# EAGLE schematic framMega (EAGLE 8.3.0)

## Sheet 1 of 9
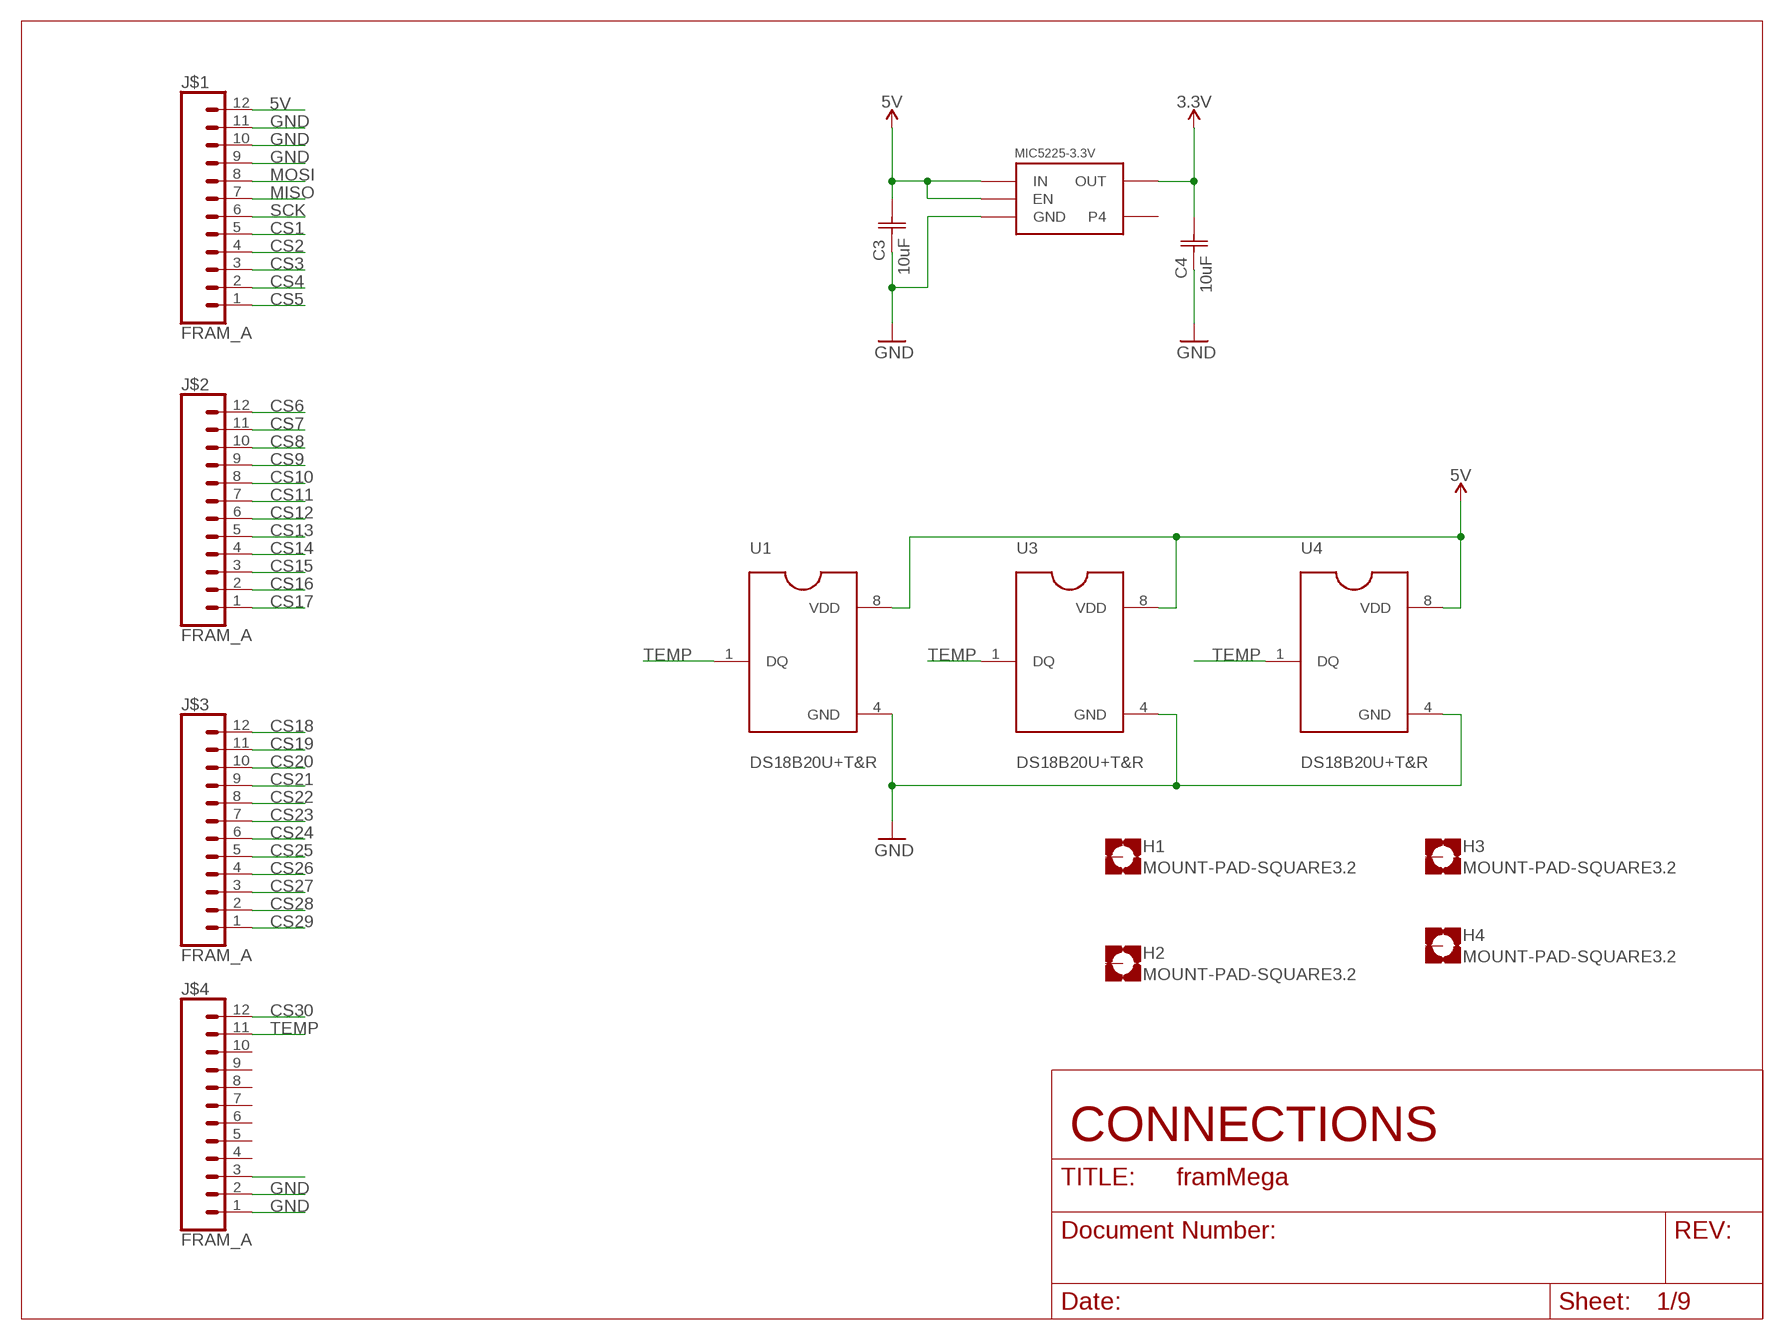
[diagram p0: schematic, sheet 1]

### Parts
C3  10uF  CAP_10UF  [CAP_GRM219R61A106KE44D]
C4  10uF  CAP_10UF  [CAP_GRM219R61A106KE44D]
H1  MOUNT-PAD-SQUARE3.2  [3,2-PAD-SQUARE]
H2  MOUNT-PAD-SQUARE3.2  [3,2-PAD-SQUARE]
H3  MOUNT-PAD-SQUARE3.2  [3,2-PAD-SQUARE]
H4  MOUNT-PAD-SQUARE3.2  [3,2-PAD-SQUARE]
J$1  FRAM_A  WIREPOST  [WIREWRAPPOST]
J$2  FRAM_A  WIREPOST  [WIREWRAPPOST]
J$3  FRAM_A  WIREPOST  [WIREWRAPPOST]
J$4  FRAM_A  WIREPOST  [WIREWRAPPOST]
U1  DS18B20U+T&R  [SOP65P500X110-8N]
U2  MIC5225  [SOT23-5]
U3  DS18B20U+T&R  [SOP65P500X110-8N]
U4  DS18B20U+T&R  [SOP65P500X110-8N]

### Nets
3.3V: C4.2 U2.OUT ; also sheet 2,3,4,5,6,7,8,9
5V [power usb]: C3.2 J$1.12 J$4.3 U1.8(VDD) U2.EN U2.IN U3.8(VDD) U4.8(VDD) ; also sheet 2,3,4
CS1: J$1.5 ; also sheet 2
CS2: J$1.4 ; also sheet 2
CS3: J$1.3 ; also sheet 2
CS4: J$1.2 ; also sheet 2
CS5: J$1.1 ; also sheet 2
CS6: J$2.12 ; also sheet 2
CS7: J$2.11 ; also sheet 2
CS8: J$2.10 ; also sheet 2
CS9: J$2.9 ; also sheet 2
CS10: J$2.8 ; also sheet 2
CS11: J$2.7 ; also sheet 2
CS12: J$2.6 ; also sheet 3
CS13: J$2.5 ; also sheet 3
CS14: J$2.4 ; also sheet 3
CS15: J$2.3 ; also sheet 3
CS16: J$2.2 ; also sheet 3
CS17: J$2.1 ; also sheet 3
CS18: J$3.12 ; also sheet 3
CS19: J$3.11 ; also sheet 3
CS20: J$3.10 ; also sheet 3
CS21: J$3.9 ; also sheet 3
CS22: J$3.8 ; also sheet 3
CS23: J$3.7 ; also sheet 3
CS24: J$3.6 ; also sheet 3
CS25: J$3.5 ; also sheet 3
CS26: J$3.4 ; also sheet 3
CS27: J$3.3 ; also sheet 3
CS28: J$3.2 ; also sheet 4
CS29: J$3.1 ; also sheet 4
CS30: J$4.12 ; also sheet 4
GND [gnd]: C3.1 C4.1 J$1.9 J$1.10 J$1.11 J$4.1 J$4.2 U1.4(GND) U2.GND U3.4(GND) U4.4(GND) ; also sheet 5,6,7,8,9
MISO: J$1.7 ; also sheet 2
MOSI: J$1.8 ; also sheet 2
SCK: J$1.6 ; also sheet 2
TEMP: J$4.11 U1.1(DQ) U3.1(DQ) U4.1(DQ)
Unconnected: H1.B3,2(MOUNT) H2.B3,2(MOUNT) H3.B3,2(MOUNT) H4.B3,2(MOUNT) J$4.4 J$4.5 J$4.6 J$4.7 J$4.8 J$4.9 J$4.10 U2.NC/ADJ(P4)

### Notes on the sheet
- CONNECTIONS

## Sheet 2 of 9
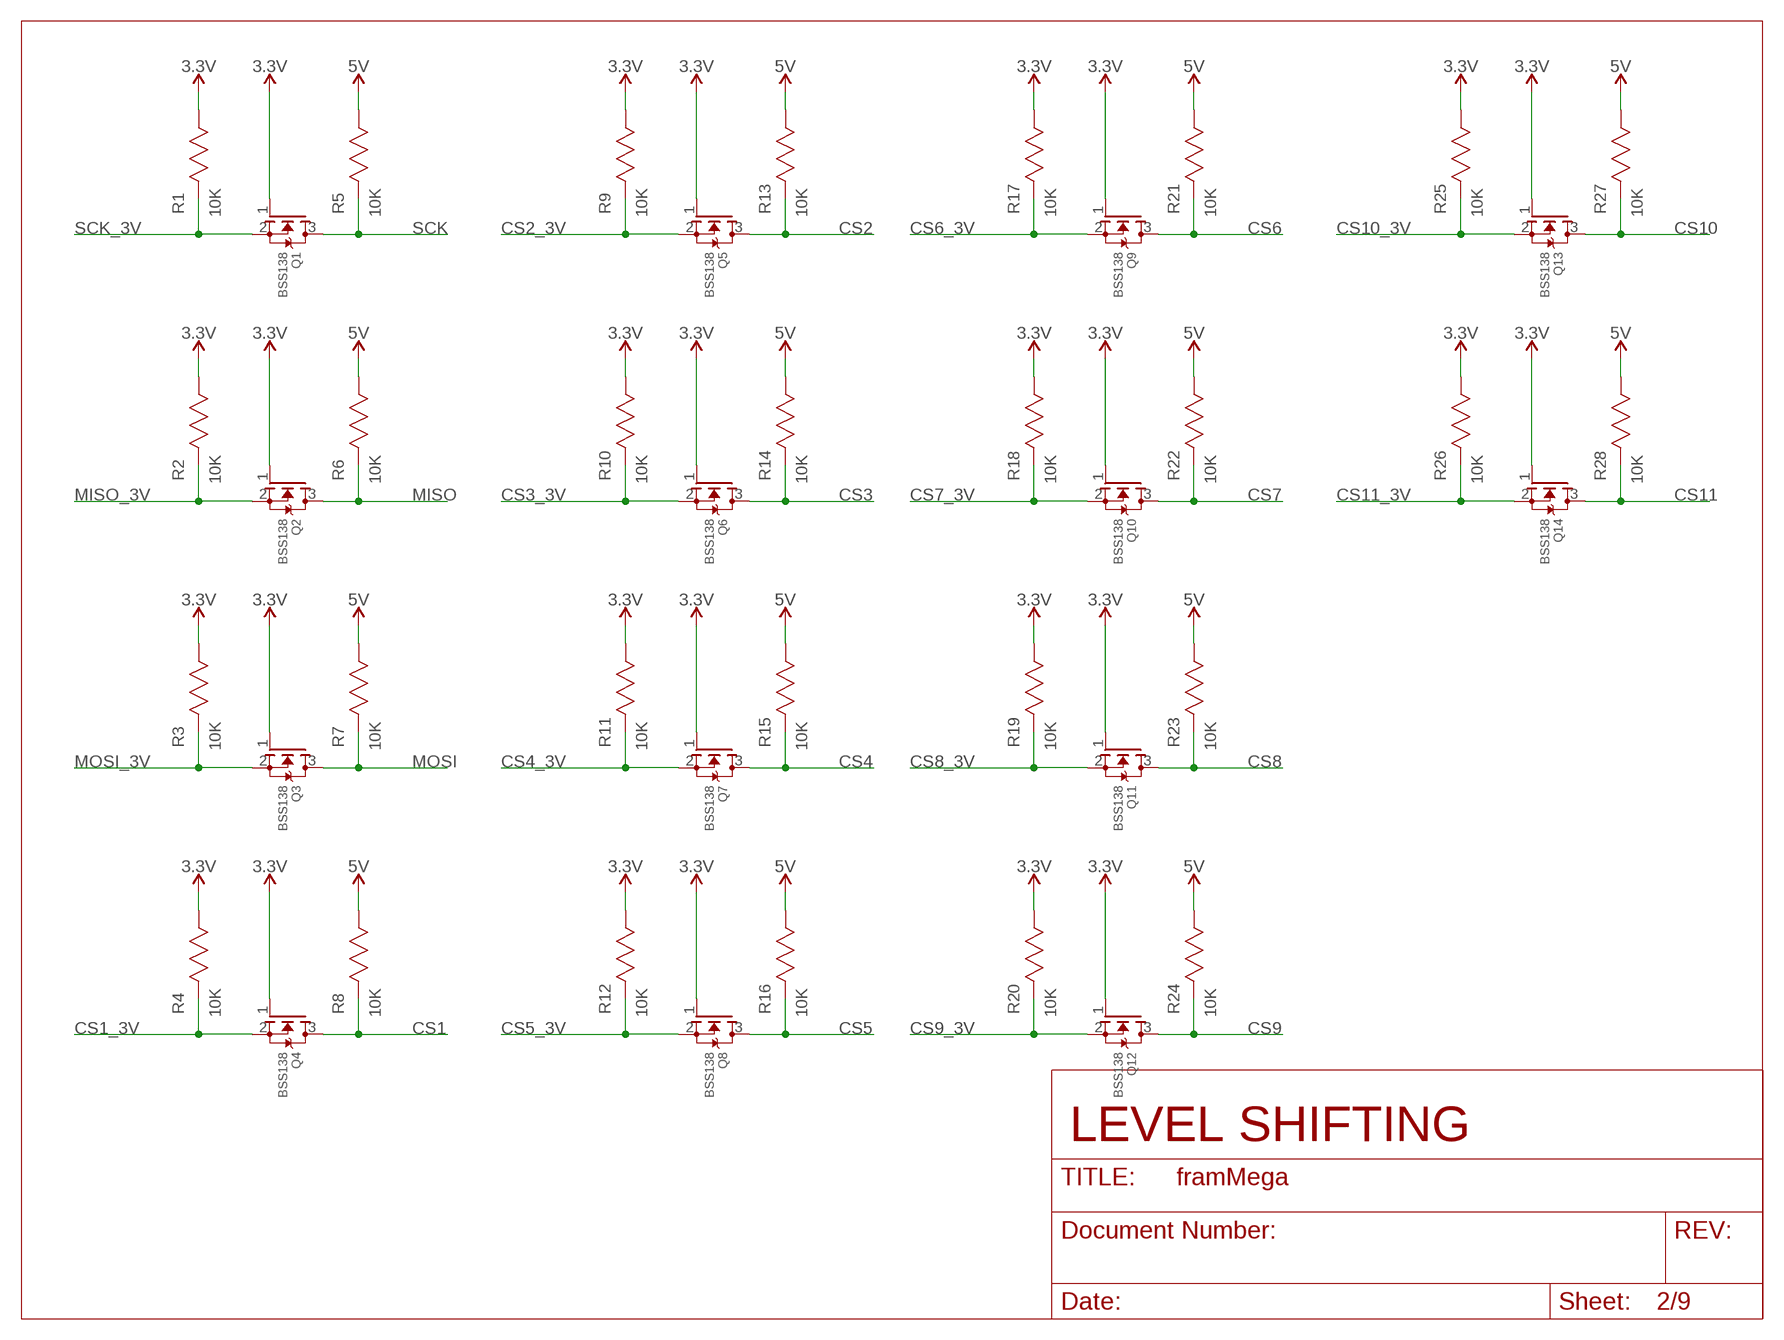
[diagram p1: schematic, sheet 2]

### Parts
Q1  BSS138  MOSFET-NWIDE  [SOT23-WIDE]
Q2  BSS138  MOSFET-NWIDE  [SOT23-WIDE]
Q3  BSS138  MOSFET-NWIDE  [SOT23-WIDE]
Q4  BSS138  MOSFET-NWIDE  [SOT23-WIDE]
Q5  BSS138  MOSFET-NWIDE  [SOT23-WIDE]
Q6  BSS138  MOSFET-NWIDE  [SOT23-WIDE]
Q7  BSS138  MOSFET-NWIDE  [SOT23-WIDE]
Q8  BSS138  MOSFET-NWIDE  [SOT23-WIDE]
Q9  BSS138  MOSFET-NWIDE  [SOT23-WIDE]
Q10  BSS138  MOSFET-NWIDE  [SOT23-WIDE]
Q11  BSS138  MOSFET-NWIDE  [SOT23-WIDE]
Q12  BSS138  MOSFET-NWIDE  [SOT23-WIDE]
Q13  BSS138  MOSFET-NWIDE  [SOT23-WIDE]
Q14  BSS138  MOSFET-NWIDE  [SOT23-WIDE]
R1  10K  RES_10K  [RC0603N]
R2  10K  RES_10K  [RC0603N]
R3  10K  RES_10K  [RC0603N]
R4  10K  RES_10K  [RC0603N]
R5  10K  RES_10K  [RC0603N]
R6  10K  RES_10K  [RC0603N]
R7  10K  RES_10K  [RC0603N]
R8  10K  RES_10K  [RC0603N]
R9  10K  RES_10K  [RC0603N]
R10  10K  RES_10K  [RC0603N]
R11  10K  RES_10K  [RC0603N]
R12  10K  RES_10K  [RC0603N]
R13  10K  RES_10K  [RC0603N]
R14  10K  RES_10K  [RC0603N]
R15  10K  RES_10K  [RC0603N]
R16  10K  RES_10K  [RC0603N]
R17  10K  RES_10K  [RC0603N]
R18  10K  RES_10K  [RC0603N]
R19  10K  RES_10K  [RC0603N]
R20  10K  RES_10K  [RC0603N]
R21  10K  RES_10K  [RC0603N]
R22  10K  RES_10K  [RC0603N]
R23  10K  RES_10K  [RC0603N]
R24  10K  RES_10K  [RC0603N]
R25  10K  RES_10K  [RC0603N]
R26  10K  RES_10K  [RC0603N]
R27  10K  RES_10K  [RC0603N]
R28  10K  RES_10K  [RC0603N]

### Nets
3.3V: Q1.1(G) Q2.1(G) Q3.1(G) Q4.1(G) Q5.1(G) Q6.1(G) Q7.1(G) Q8.1(G) Q9.1(G) Q10.1(G) Q11.1(G) Q12.1(G) Q13.1(G) Q14.1(G) R1.1 R2.1 R3.1 R4.1 R9.1 R10.1 R11.1 R12.1 R17.1 R18.1 R19.1 R20.1 R25.1 R26.1 ; also sheet 1,3,4,5,6,7,8,9
5V [power usb]: R5.1 R6.1 R7.1 R8.1 R13.1 R14.1 R15.1 R16.1 R21.1 R22.1 R23.1 R24.1 R27.1 R28.1 ; also sheet 1,3,4
CS1: Q4.3(D) R8.2 ; also sheet 1
CS1_3V: Q4.2(S) R4.2 ; also sheet 5
CS2: Q5.3(D) R13.2 ; also sheet 1
CS2_3V: Q5.2(S) R9.2 ; also sheet 5
CS3: Q6.3(D) R14.2 ; also sheet 1
CS3_3V: Q6.2(S) R10.2 ; also sheet 5
CS4: Q7.3(D) R15.2 ; also sheet 1
CS4_3V: Q7.2(S) R11.2 ; also sheet 5
CS5: Q8.3(D) R16.2 ; also sheet 1
CS5_3V: Q8.2(S) R12.2 ; also sheet 5
CS6: Q9.3(D) R21.2 ; also sheet 1
CS6_3V: Q9.2(S) R17.2 ; also sheet 5
CS7: Q10.3(D) R22.2 ; also sheet 1
CS7_3V: Q10.2(S) R18.2 ; also sheet 6
CS8: Q11.3(D) R23.2 ; also sheet 1
CS8_3V: Q11.2(S) R19.2 ; also sheet 6
CS9: Q12.3(D) R24.2 ; also sheet 1
CS9_3V: Q12.2(S) R20.2 ; also sheet 6
CS10: Q13.3(D) R27.2 ; also sheet 1
CS10_3V: Q13.2(S) R25.2 ; also sheet 6
CS11: Q14.3(D) R28.2 ; also sheet 1
CS11_3V: Q14.2(S) R26.2 ; also sheet 6
MISO: Q2.3(D) R6.2 ; also sheet 1
MISO_3V: Q2.2(S) R2.2 ; also sheet 5,6,7,8,9
MOSI: Q3.3(D) R7.2 ; also sheet 1
MOSI_3V: Q3.2(S) R3.2 ; also sheet 5,6,7,8,9
SCK: Q1.3(D) R5.2 ; also sheet 1
SCK_3V: Q1.2(S) R1.2 ; also sheet 5,6,7,8,9

### Notes on the sheet
- LEVEL SHIFTING

## Sheet 3 of 9
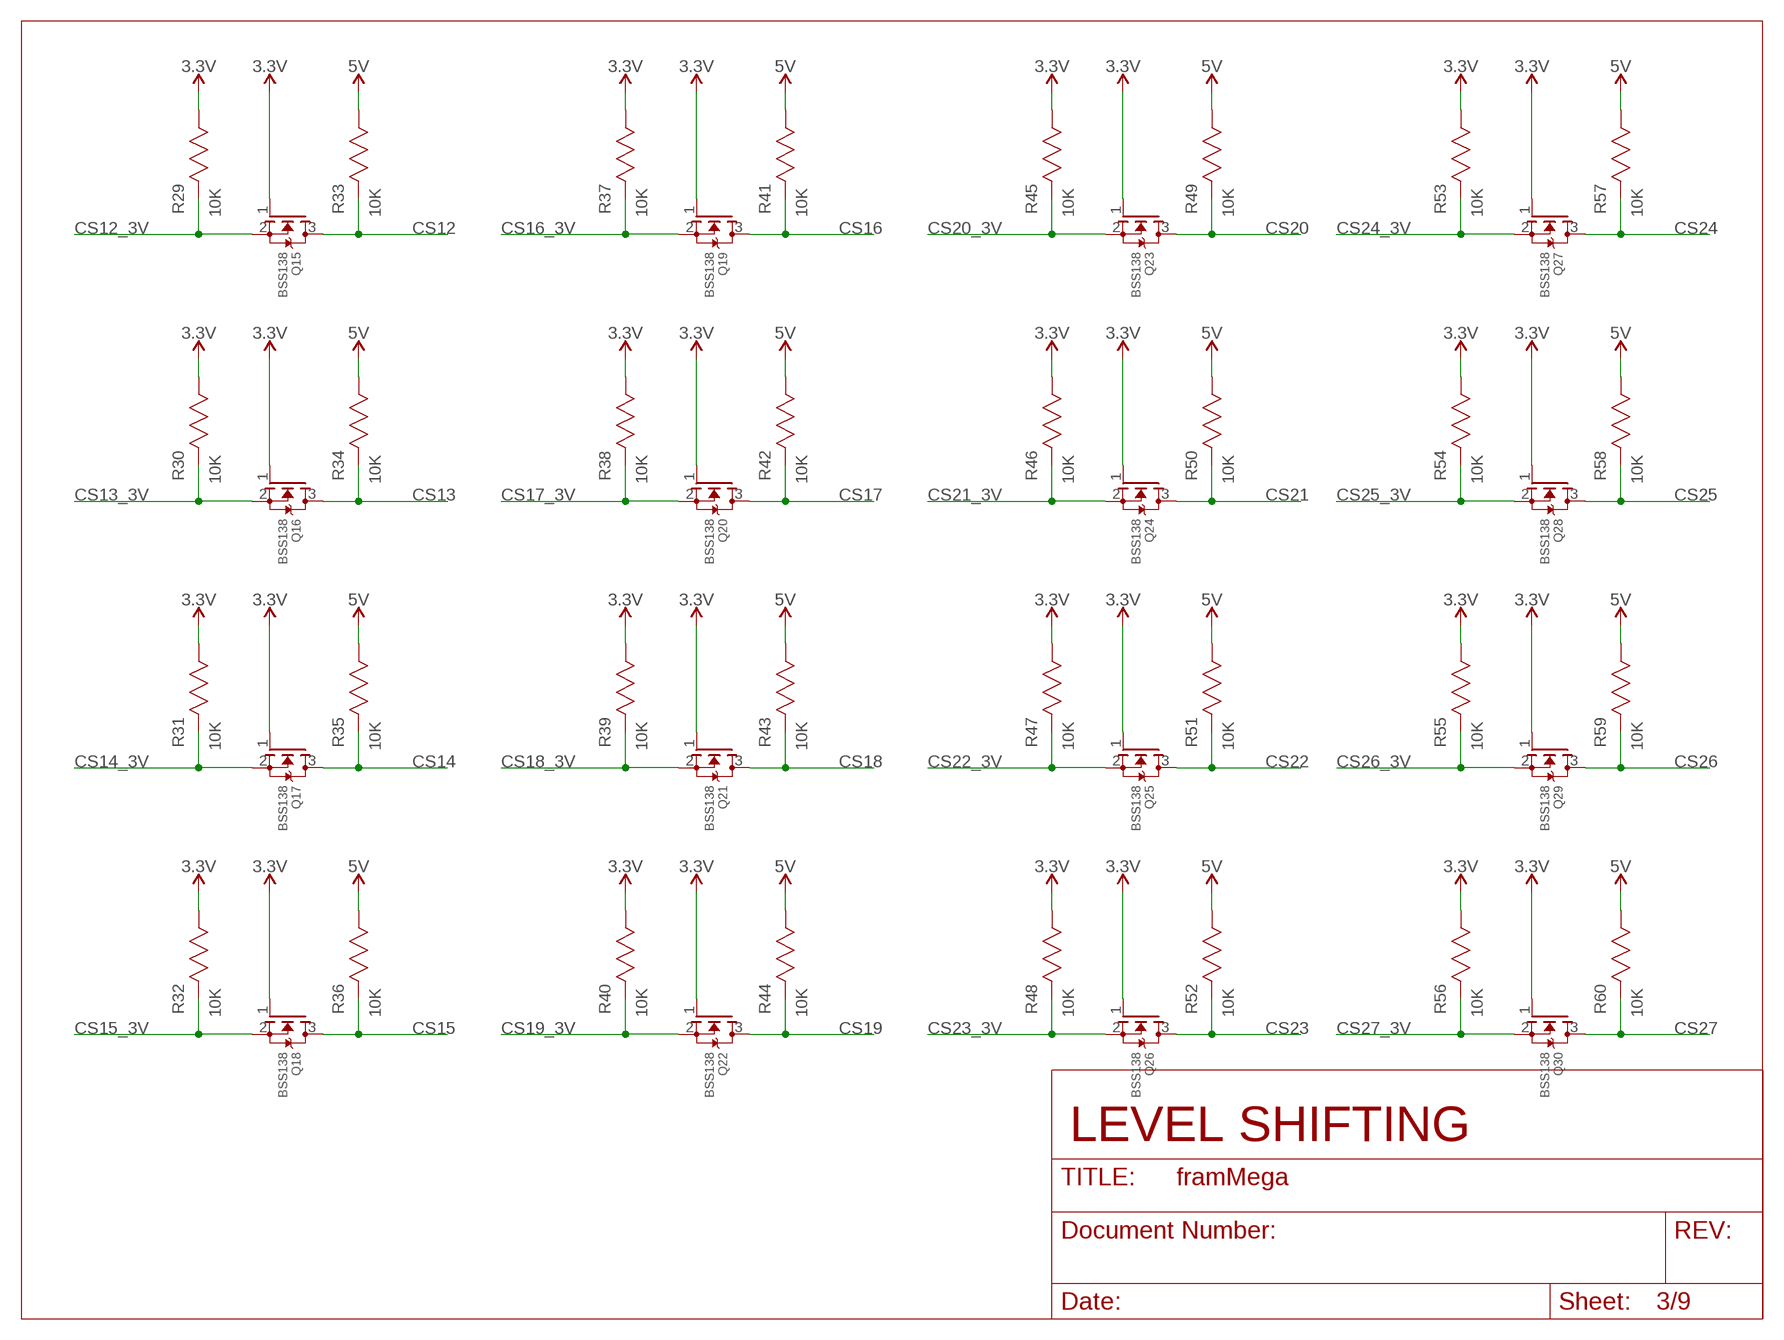
[diagram p2: schematic, sheet 3]

### Parts
Q15  BSS138  MOSFET-NWIDE  [SOT23-WIDE]
Q16  BSS138  MOSFET-NWIDE  [SOT23-WIDE]
Q17  BSS138  MOSFET-NWIDE  [SOT23-WIDE]
Q18  BSS138  MOSFET-NWIDE  [SOT23-WIDE]
Q19  BSS138  MOSFET-NWIDE  [SOT23-WIDE]
Q20  BSS138  MOSFET-NWIDE  [SOT23-WIDE]
Q21  BSS138  MOSFET-NWIDE  [SOT23-WIDE]
Q22  BSS138  MOSFET-NWIDE  [SOT23-WIDE]
Q23  BSS138  MOSFET-NWIDE  [SOT23-WIDE]
Q24  BSS138  MOSFET-NWIDE  [SOT23-WIDE]
Q25  BSS138  MOSFET-NWIDE  [SOT23-WIDE]
Q26  BSS138  MOSFET-NWIDE  [SOT23-WIDE]
Q27  BSS138  MOSFET-NWIDE  [SOT23-WIDE]
Q28  BSS138  MOSFET-NWIDE  [SOT23-WIDE]
Q29  BSS138  MOSFET-NWIDE  [SOT23-WIDE]
Q30  BSS138  MOSFET-NWIDE  [SOT23-WIDE]
R29  10K  RES_10K  [RC0603N]
R30  10K  RES_10K  [RC0603N]
R31  10K  RES_10K  [RC0603N]
R32  10K  RES_10K  [RC0603N]
R33  10K  RES_10K  [RC0603N]
R34  10K  RES_10K  [RC0603N]
R35  10K  RES_10K  [RC0603N]
R36  10K  RES_10K  [RC0603N]
R37  10K  RES_10K  [RC0603N]
R38  10K  RES_10K  [RC0603N]
R39  10K  RES_10K  [RC0603N]
R40  10K  RES_10K  [RC0603N]
R41  10K  RES_10K  [RC0603N]
R42  10K  RES_10K  [RC0603N]
R43  10K  RES_10K  [RC0603N]
R44  10K  RES_10K  [RC0603N]
R45  10K  RES_10K  [RC0603N]
R46  10K  RES_10K  [RC0603N]
R47  10K  RES_10K  [RC0603N]
R48  10K  RES_10K  [RC0603N]
R49  10K  RES_10K  [RC0603N]
R50  10K  RES_10K  [RC0603N]
R51  10K  RES_10K  [RC0603N]
R52  10K  RES_10K  [RC0603N]
R53  10K  RES_10K  [RC0603N]
R54  10K  RES_10K  [RC0603N]
R55  10K  RES_10K  [RC0603N]
R56  10K  RES_10K  [RC0603N]
R57  10K  RES_10K  [RC0603N]
R58  10K  RES_10K  [RC0603N]
R59  10K  RES_10K  [RC0603N]
R60  10K  RES_10K  [RC0603N]

### Nets
3.3V: Q15.1(G) Q16.1(G) Q17.1(G) Q18.1(G) Q19.1(G) Q20.1(G) Q21.1(G) Q22.1(G) Q23.1(G) Q24.1(G) Q25.1(G) Q26.1(G) Q27.1(G) Q28.1(G) Q29.1(G) Q30.1(G) R29.1 R30.1 R31.1 R32.1 R37.1 R38.1 R39.1 R40.1 R45.1 R46.1 R47.1 R48.1 R53.1 R54.1 R55.1 R56.1 ; also sheet 1,2,4,5,6,7,8,9
5V [power usb]: R33.1 R34.1 R35.1 R36.1 R41.1 R42.1 R43.1 R44.1 R49.1 R50.1 R51.1 R52.1 R57.1 R58.1 R59.1 R60.1 ; also sheet 1,2,4
CS12: Q15.3(D) R33.2 ; also sheet 1
CS12_3V: Q15.2(S) R29.2 ; also sheet 6
CS13: Q16.3(D) R34.2 ; also sheet 1
CS13_3V: Q16.2(S) R30.2 ; also sheet 7
CS14: Q17.3(D) R35.2 ; also sheet 1
CS14_3V: Q17.2(S) R31.2 ; also sheet 7
CS15: Q18.3(D) R36.2 ; also sheet 1
CS15_3V: Q18.2(S) R32.2 ; also sheet 7
CS16: Q19.3(D) R41.2 ; also sheet 1
CS16_3V: Q19.2(S) R37.2 ; also sheet 7
CS17: Q20.3(D) R42.2 ; also sheet 1
CS17_3V: Q20.2(S) R38.2 ; also sheet 7
CS18: Q21.3(D) R43.2 ; also sheet 1
CS18_3V: Q21.2(S) R39.2 ; also sheet 7
CS19: Q22.3(D) R44.2 ; also sheet 1
CS19_3V: Q22.2(S) R40.2 ; also sheet 8
CS20: Q23.3(D) R49.2 ; also sheet 1
CS20_3V: Q23.2(S) R45.2 ; also sheet 8
CS21: Q24.3(D) R50.2 ; also sheet 1
CS21_3V: Q24.2(S) R46.2 ; also sheet 8
CS22: Q25.3(D) R51.2 ; also sheet 1
CS22_3V: Q25.2(S) R47.2 ; also sheet 8
CS23: Q26.3(D) R52.2 ; also sheet 1
CS23_3V: Q26.2(S) R48.2 ; also sheet 8
CS24: Q27.3(D) R57.2 ; also sheet 1
CS24_3V: Q27.2(S) R53.2 ; also sheet 8
CS25: Q28.3(D) R58.2 ; also sheet 1
CS25_3V: Q28.2(S) R54.2 ; also sheet 9
CS26: Q29.3(D) R59.2 ; also sheet 1
CS26_3V: Q29.2(S) R55.2 ; also sheet 9
CS27: Q30.3(D) R60.2 ; also sheet 1
CS27_3V: Q30.2(S) R56.2 ; also sheet 9

### Notes on the sheet
- LEVEL SHIFTING

## Sheet 4 of 9
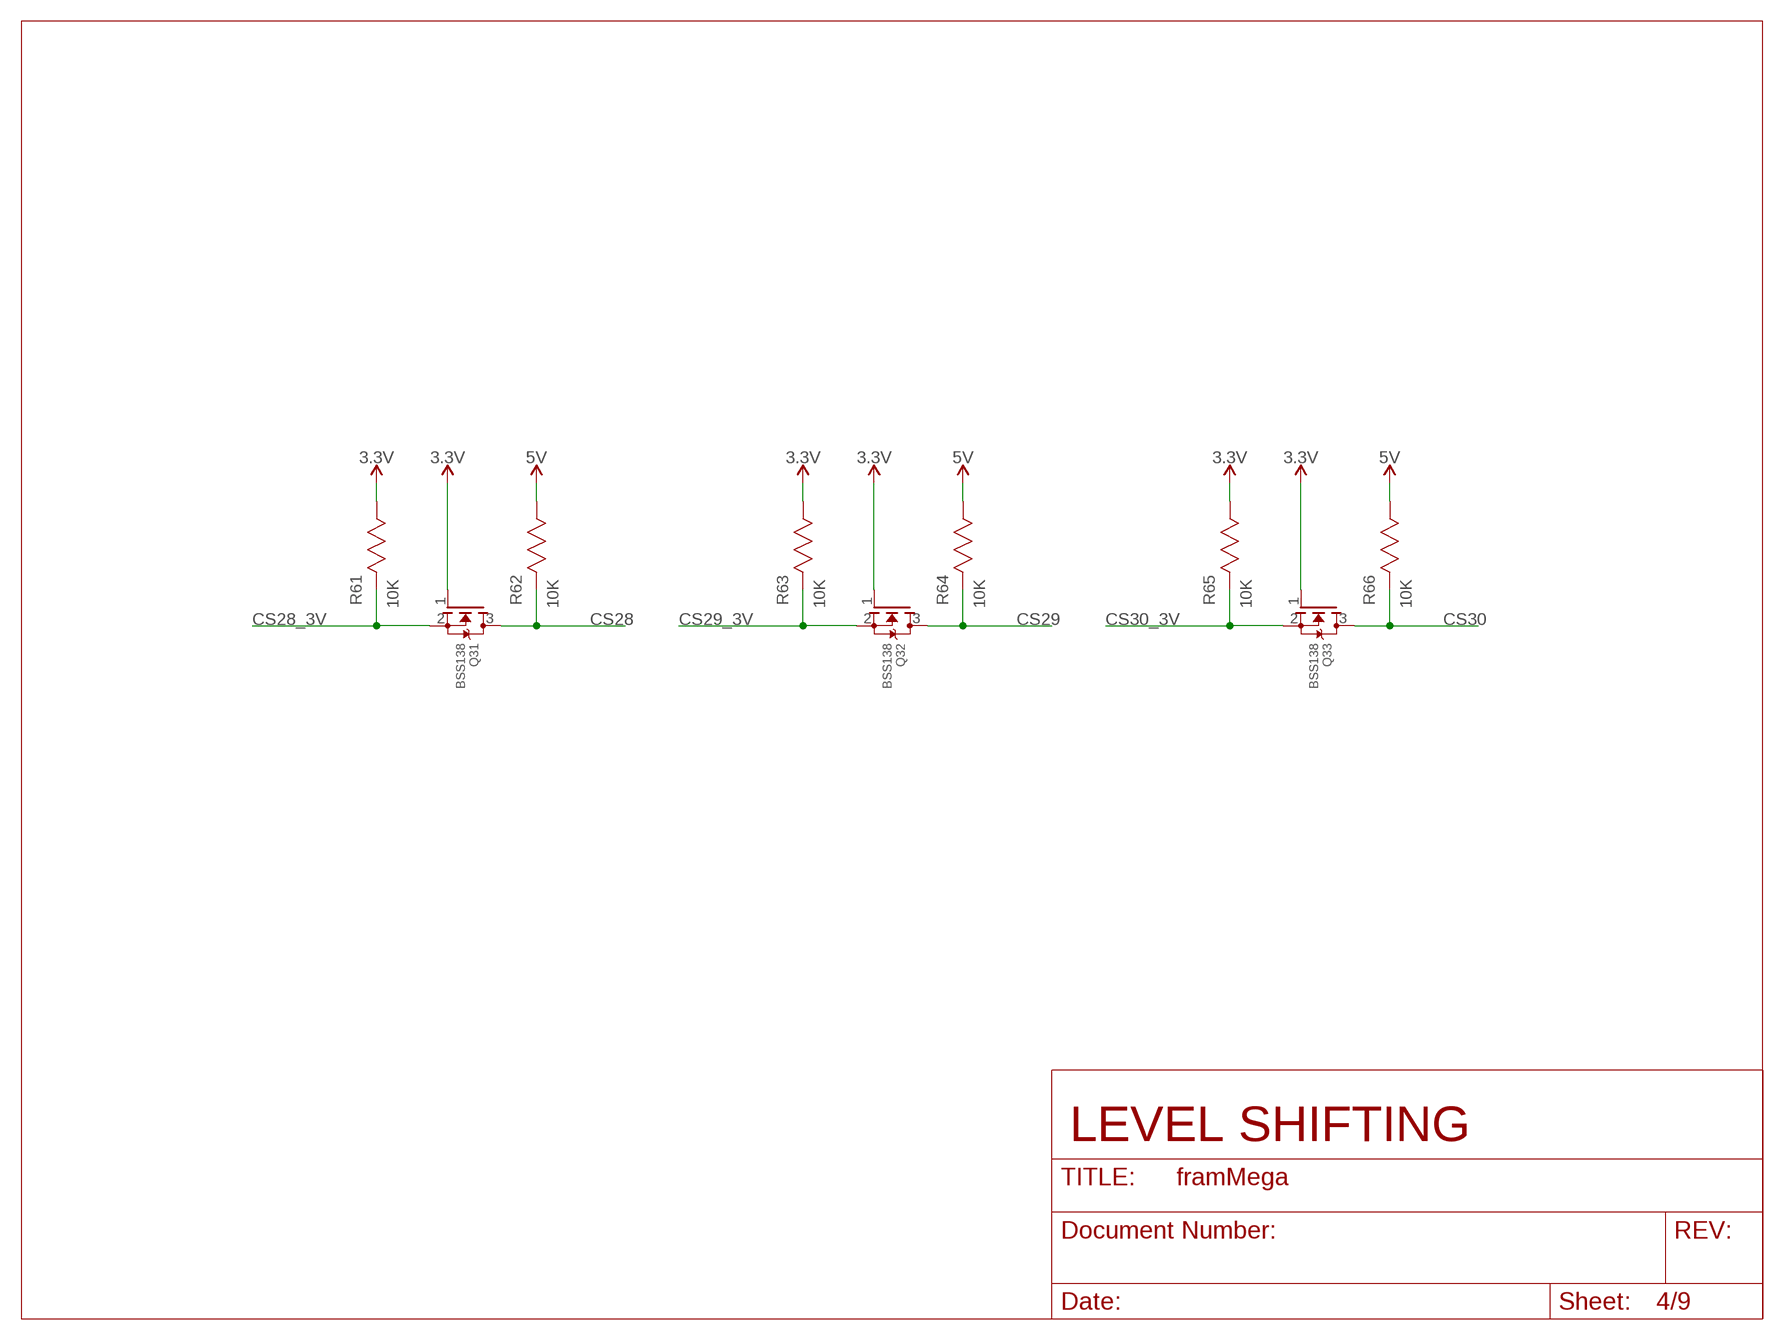
[diagram p3: schematic, sheet 4]

### Parts
Q31  BSS138  MOSFET-NWIDE  [SOT23-WIDE]
Q32  BSS138  MOSFET-NWIDE  [SOT23-WIDE]
Q33  BSS138  MOSFET-NWIDE  [SOT23-WIDE]
R61  10K  RES_10K  [RC0603N]
R62  10K  RES_10K  [RC0603N]
R63  10K  RES_10K  [RC0603N]
R64  10K  RES_10K  [RC0603N]
R65  10K  RES_10K  [RC0603N]
R66  10K  RES_10K  [RC0603N]

### Nets
3.3V: Q31.1(G) Q32.1(G) Q33.1(G) R61.1 R63.1 R65.1 ; also sheet 1,2,3,5,6,7,8,9
5V [power usb]: R62.1 R64.1 R66.1 ; also sheet 1,2,3
CS28: Q31.3(D) R62.2 ; also sheet 1
CS28_3V: Q31.2(S) R61.2 ; also sheet 9
CS29: Q32.3(D) R64.2 ; also sheet 1
CS29_3V: Q32.2(S) R63.2 ; also sheet 9
CS30: Q33.3(D) R66.2 ; also sheet 1
CS30_3V: Q33.2(S) R65.2 ; also sheet 9

### Notes on the sheet
- LEVEL SHIFTING

## Sheet 5 of 9
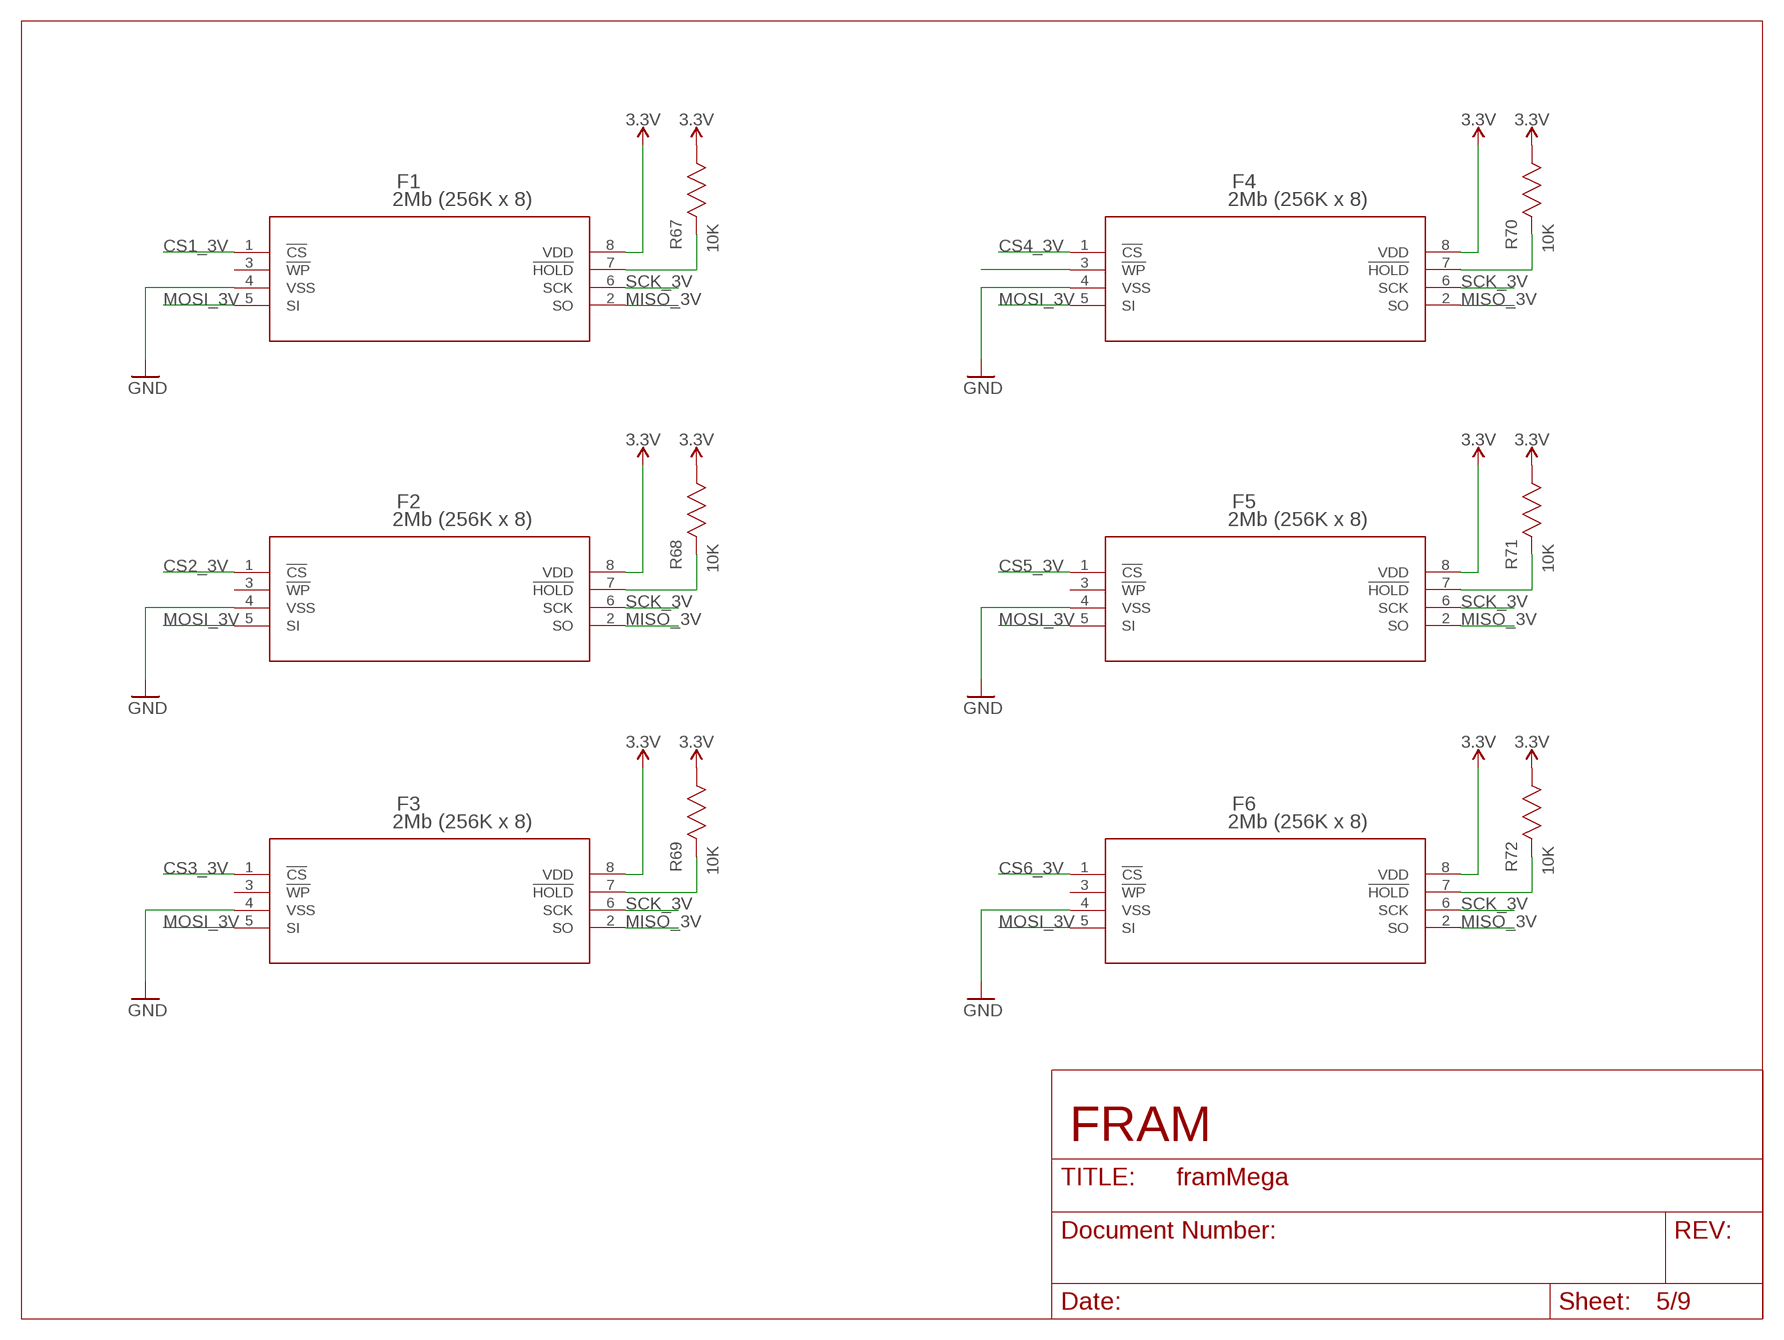
[diagram p4: schematic, sheet 5]

### Parts
F1  2Mb (256K x 8)  FRAM_MB85RS2MTA  [FRAM_MB85RS2MTA_FPT-8P-M09]
F2  2Mb (256K x 8)  FRAM_MB85RS2MTA  [FRAM_MB85RS2MTA_FPT-8P-M09]
F3  2Mb (256K x 8)  FRAM_MB85RS2MTA  [FRAM_MB85RS2MTA_FPT-8P-M09]
F4  2Mb (256K x 8)  FRAM_MB85RS2MTA  [FRAM_MB85RS2MTA_FPT-8P-M09]
F5  2Mb (256K x 8)  FRAM_MB85RS2MTA  [FRAM_MB85RS2MTA_FPT-8P-M09]
F6  2Mb (256K x 8)  FRAM_MB85RS2MTA  [FRAM_MB85RS2MTA_FPT-8P-M09]
R67  10K  RES_10K  [RC0603N]
R68  10K  RES_10K  [RC0603N]
R69  10K  RES_10K  [RC0603N]
R70  10K  RES_10K  [RC0603N]
R71  10K  RES_10K  [RC0603N]
R72  10K  RES_10K  [RC0603N]

### Nets
3.3V: F1.8(VDD) F2.8(VDD) F3.8(VDD) F4.8(VDD) F5.8(VDD) F6.8(VDD) R67.1 R68.1 R69.1 R70.1 R71.1 R72.1 ; also sheet 1,2,3,4,6,7,8,9
CS1_3V: F1.1(!CS) ; also sheet 2
CS2_3V: F2.1(!CS) ; also sheet 2
CS3_3V: F3.1(!CS) ; also sheet 2
CS4_3V: F4.1(!CS) ; also sheet 2
CS5_3V: F5.1(!CS) ; also sheet 2
CS6_3V: F6.1(!CS) ; also sheet 2
GND [gnd]: F1.4(VSS) F2.4(VSS) F3.4(VSS) F4.4(VSS) F5.4(VSS) F6.4(VSS) ; also sheet 1,6,7,8,9
MISO_3V: F1.2(SO) F2.2(SO) F3.2(SO) F4.2(SO) F5.2(SO) F6.2(SO) ; also sheet 2,6,7,8,9
MOSI_3V: F1.5(SI) F2.5(SI) F3.5(SI) F4.5(SI) F5.5(SI) F6.5(SI) ; also sheet 2,6,7,8,9
N$43: F1.7(!HOLD) R67.2
N$45: F4.7(!HOLD) R70.2
N$46: F4.3(!WP)
N$47: F2.7(!HOLD) R68.2
N$49: F5.7(!HOLD) R71.2
N$51: F3.7(!HOLD) R69.2
N$53: F6.7(!HOLD) R72.2
SCK_3V: F1.6(SCK) F2.6(SCK) F3.6(SCK) F4.6(SCK) F5.6(SCK) F6.6(SCK) ; also sheet 2,6,7,8,9
Unconnected: F1.3(!WP) F2.3(!WP) F3.3(!WP) F5.3(!WP) F6.3(!WP)

### Notes on the sheet
- FRAM

## Sheet 6 of 9
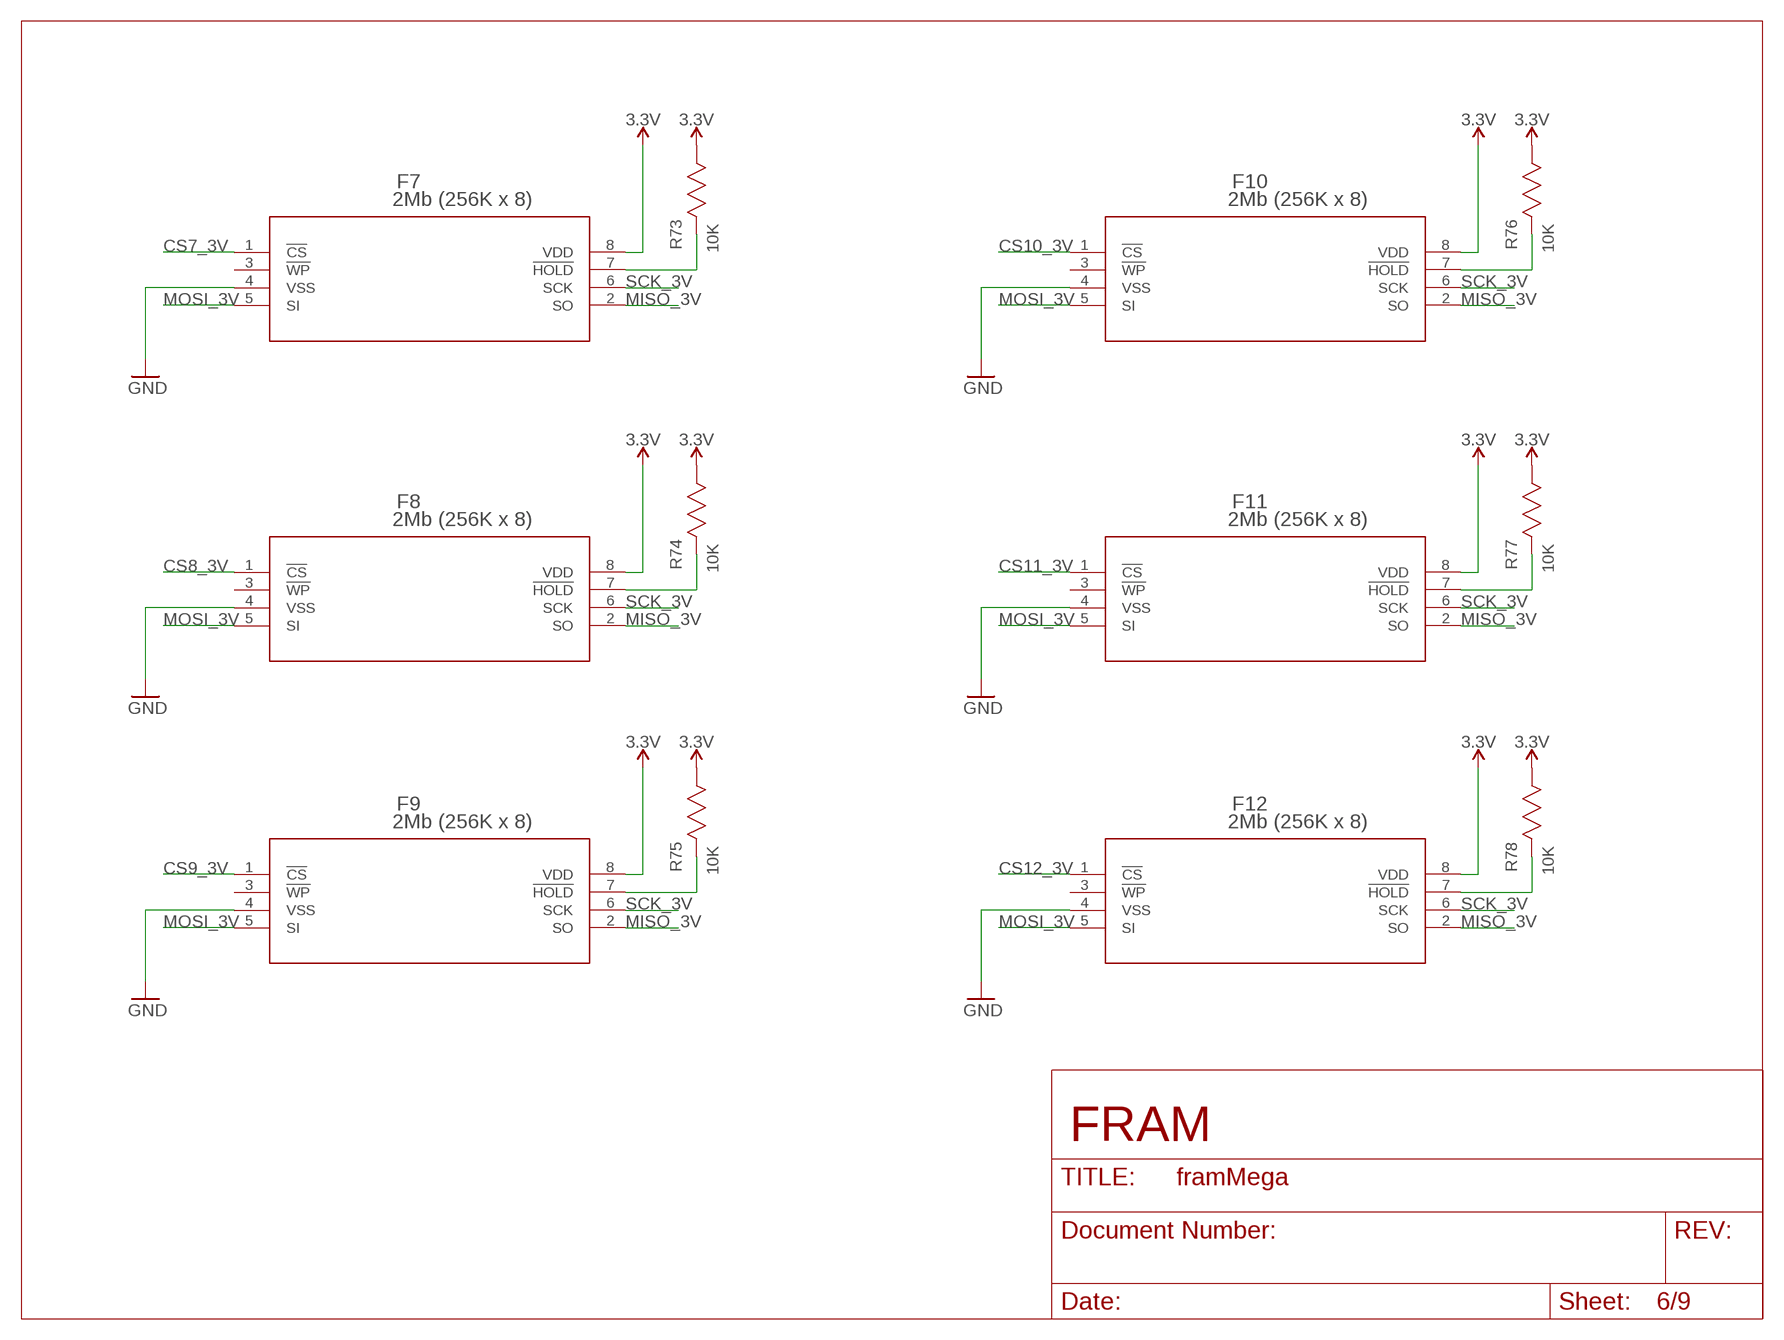
[diagram p5: schematic, sheet 6]

### Parts
F7  2Mb (256K x 8)  FRAM_MB85RS2MTA  [FRAM_MB85RS2MTA_FPT-8P-M09]
F8  2Mb (256K x 8)  FRAM_MB85RS2MTA  [FRAM_MB85RS2MTA_FPT-8P-M09]
F9  2Mb (256K x 8)  FRAM_MB85RS2MTA  [FRAM_MB85RS2MTA_FPT-8P-M09]
F10  2Mb (256K x 8)  FRAM_MB85RS2MTA  [FRAM_MB85RS2MTA_FPT-8P-M09]
F11  2Mb (256K x 8)  FRAM_MB85RS2MTA  [FRAM_MB85RS2MTA_FPT-8P-M09]
F12  2Mb (256K x 8)  FRAM_MB85RS2MTA  [FRAM_MB85RS2MTA_FPT-8P-M09]
R73  10K  RES_10K  [RC0603N]
R74  10K  RES_10K  [RC0603N]
R75  10K  RES_10K  [RC0603N]
R76  10K  RES_10K  [RC0603N]
R77  10K  RES_10K  [RC0603N]
R78  10K  RES_10K  [RC0603N]

### Nets
3.3V: F7.8(VDD) F8.8(VDD) F9.8(VDD) F10.8(VDD) F11.8(VDD) F12.8(VDD) R73.1 R74.1 R75.1 R76.1 R77.1 R78.1 ; also sheet 1,2,3,4,5,7,8,9
CS7_3V: F7.1(!CS) ; also sheet 2
CS8_3V: F8.1(!CS) ; also sheet 2
CS9_3V: F9.1(!CS) ; also sheet 2
CS10_3V: F10.1(!CS) ; also sheet 2
CS11_3V: F11.1(!CS) ; also sheet 2
CS12_3V: F12.1(!CS) ; also sheet 3
GND [gnd]: F7.4(VSS) F8.4(VSS) F9.4(VSS) F10.4(VSS) F11.4(VSS) F12.4(VSS) ; also sheet 1,5,7,8,9
MISO_3V: F7.2(SO) F8.2(SO) F9.2(SO) F10.2(SO) F11.2(SO) F12.2(SO) ; also sheet 2,5,7,8,9
MOSI_3V: F7.5(SI) F8.5(SI) F9.5(SI) F10.5(SI) F11.5(SI) F12.5(SI) ; also sheet 2,5,7,8,9
N$55: F7.7(!HOLD) R73.2
N$57: F10.7(!HOLD) R76.2
N$59: F8.7(!HOLD) R74.2
N$61: F11.7(!HOLD) R77.2
N$63: F9.7(!HOLD) R75.2
N$65: F12.7(!HOLD) R78.2
SCK_3V: F7.6(SCK) F8.6(SCK) F9.6(SCK) F10.6(SCK) F11.6(SCK) F12.6(SCK) ; also sheet 2,5,7,8,9
Unconnected: F7.3(!WP) F8.3(!WP) F9.3(!WP) F10.3(!WP) F11.3(!WP) F12.3(!WP)

### Notes on the sheet
- FRAM

## Sheet 7 of 9
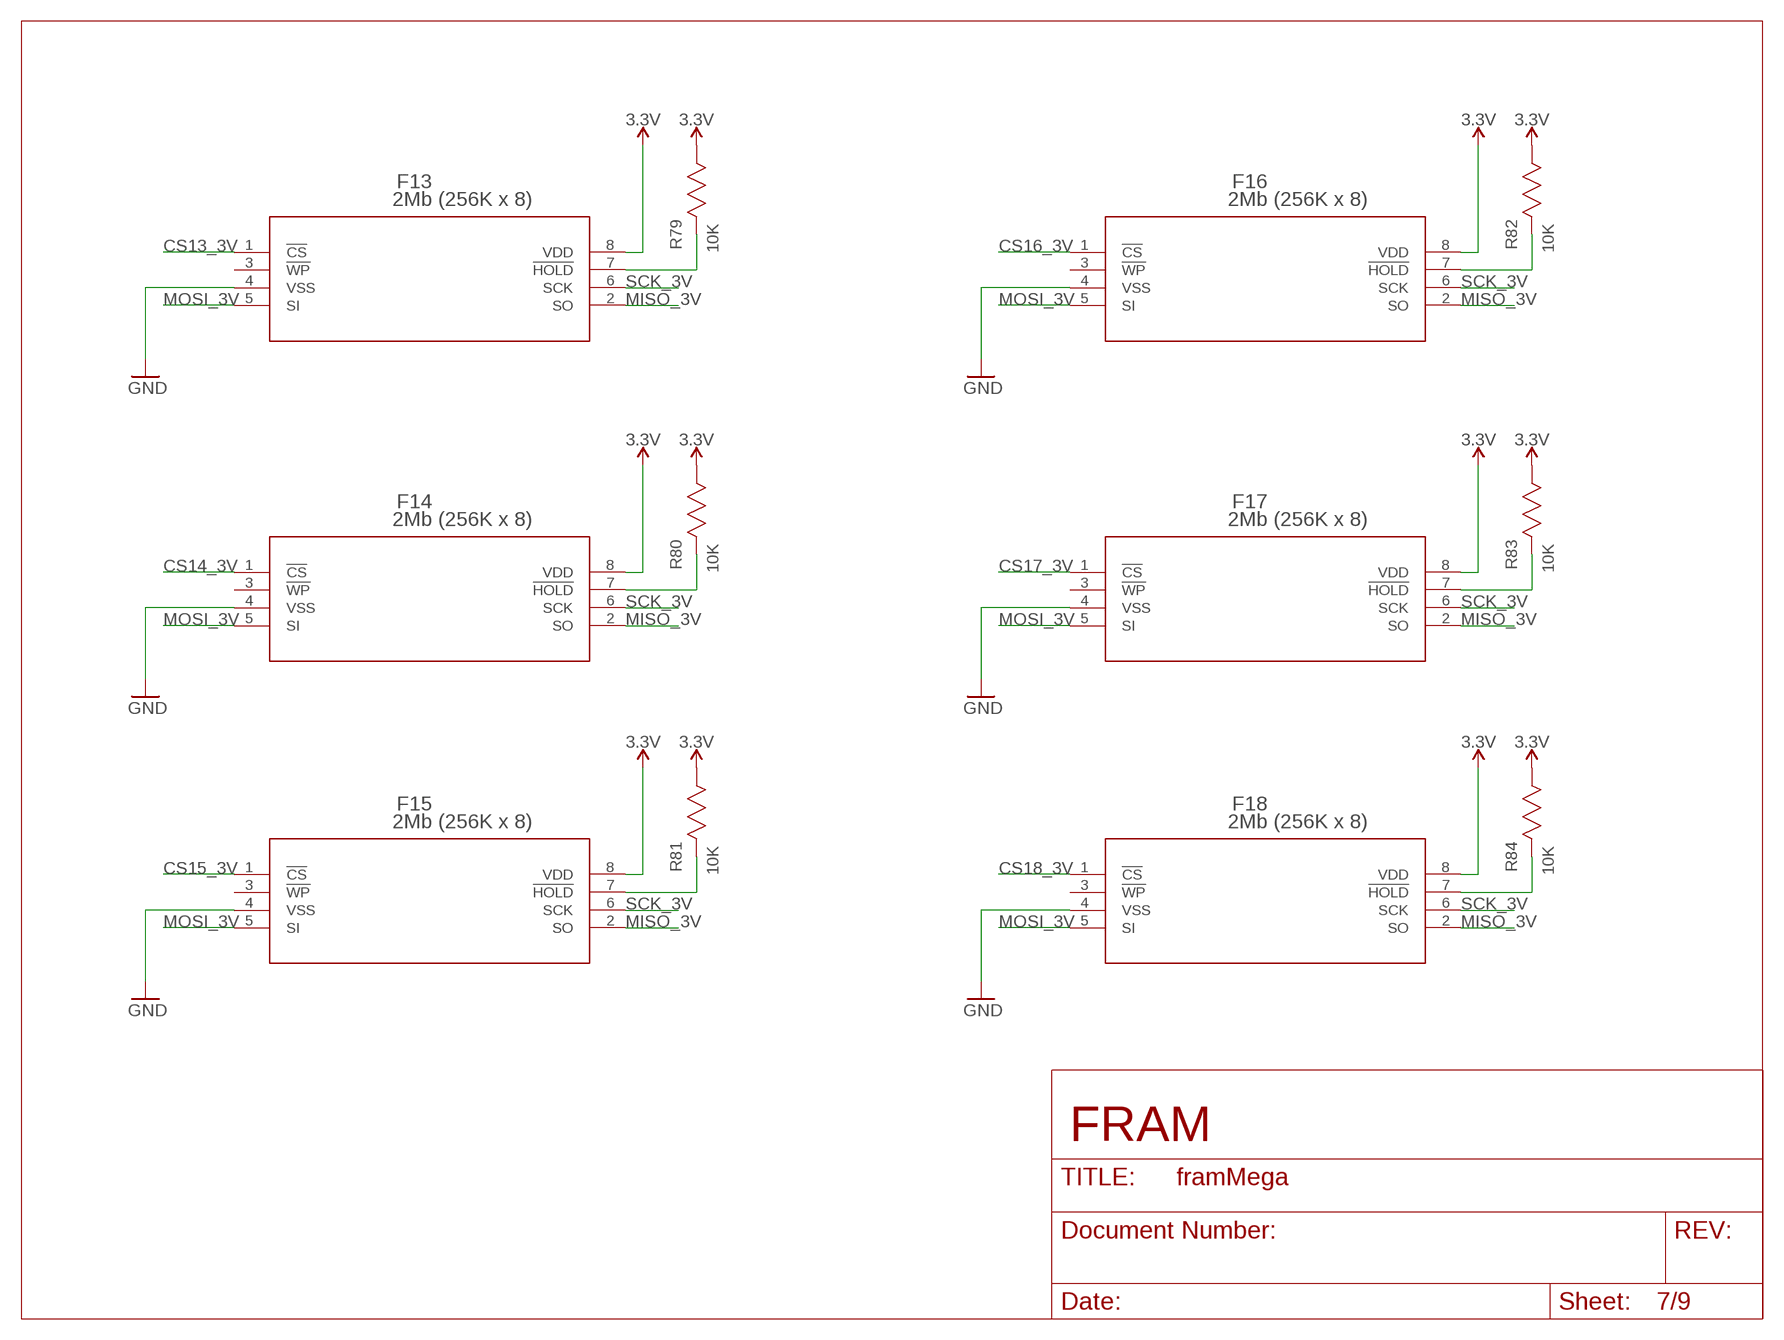
[diagram p6: schematic, sheet 7]

### Parts
F13  2Mb (256K x 8)  FRAM_MB85RS2MTA  [FRAM_MB85RS2MTA_FPT-8P-M09]
F14  2Mb (256K x 8)  FRAM_MB85RS2MTA  [FRAM_MB85RS2MTA_FPT-8P-M09]
F15  2Mb (256K x 8)  FRAM_MB85RS2MTA  [FRAM_MB85RS2MTA_FPT-8P-M09]
F16  2Mb (256K x 8)  FRAM_MB85RS2MTA  [FRAM_MB85RS2MTA_FPT-8P-M09]
F17  2Mb (256K x 8)  FRAM_MB85RS2MTA  [FRAM_MB85RS2MTA_FPT-8P-M09]
F18  2Mb (256K x 8)  FRAM_MB85RS2MTA  [FRAM_MB85RS2MTA_FPT-8P-M09]
R79  10K  RES_10K  [RC0603N]
R80  10K  RES_10K  [RC0603N]
R81  10K  RES_10K  [RC0603N]
R82  10K  RES_10K  [RC0603N]
R83  10K  RES_10K  [RC0603N]
R84  10K  RES_10K  [RC0603N]

### Nets
3.3V: F13.8(VDD) F14.8(VDD) F15.8(VDD) F16.8(VDD) F17.8(VDD) F18.8(VDD) R79.1 R80.1 R81.1 R82.1 R83.1 R84.1 ; also sheet 1,2,3,4,5,6,8,9
CS13_3V: F13.1(!CS) ; also sheet 3
CS14_3V: F14.1(!CS) ; also sheet 3
CS15_3V: F15.1(!CS) ; also sheet 3
CS16_3V: F16.1(!CS) ; also sheet 3
CS17_3V: F17.1(!CS) ; also sheet 3
CS18_3V: F18.1(!CS) ; also sheet 3
GND [gnd]: F13.4(VSS) F14.4(VSS) F15.4(VSS) F16.4(VSS) F17.4(VSS) F18.4(VSS) ; also sheet 1,5,6,8,9
MISO_3V: F13.2(SO) F14.2(SO) F15.2(SO) F16.2(SO) F17.2(SO) F18.2(SO) ; also sheet 2,5,6,8,9
MOSI_3V: F13.5(SI) F14.5(SI) F15.5(SI) F16.5(SI) F17.5(SI) F18.5(SI) ; also sheet 2,5,6,8,9
N$67: F13.7(!HOLD) R79.2
N$69: F16.7(!HOLD) R82.2
N$71: F14.7(!HOLD) R80.2
N$73: F17.7(!HOLD) R83.2
N$75: F15.7(!HOLD) R81.2
N$77: F18.7(!HOLD) R84.2
SCK_3V: F13.6(SCK) F14.6(SCK) F15.6(SCK) F16.6(SCK) F17.6(SCK) F18.6(SCK) ; also sheet 2,5,6,8,9
Unconnected: F13.3(!WP) F14.3(!WP) F15.3(!WP) F16.3(!WP) F17.3(!WP) F18.3(!WP)

### Notes on the sheet
- FRAM

## Sheet 8 of 9
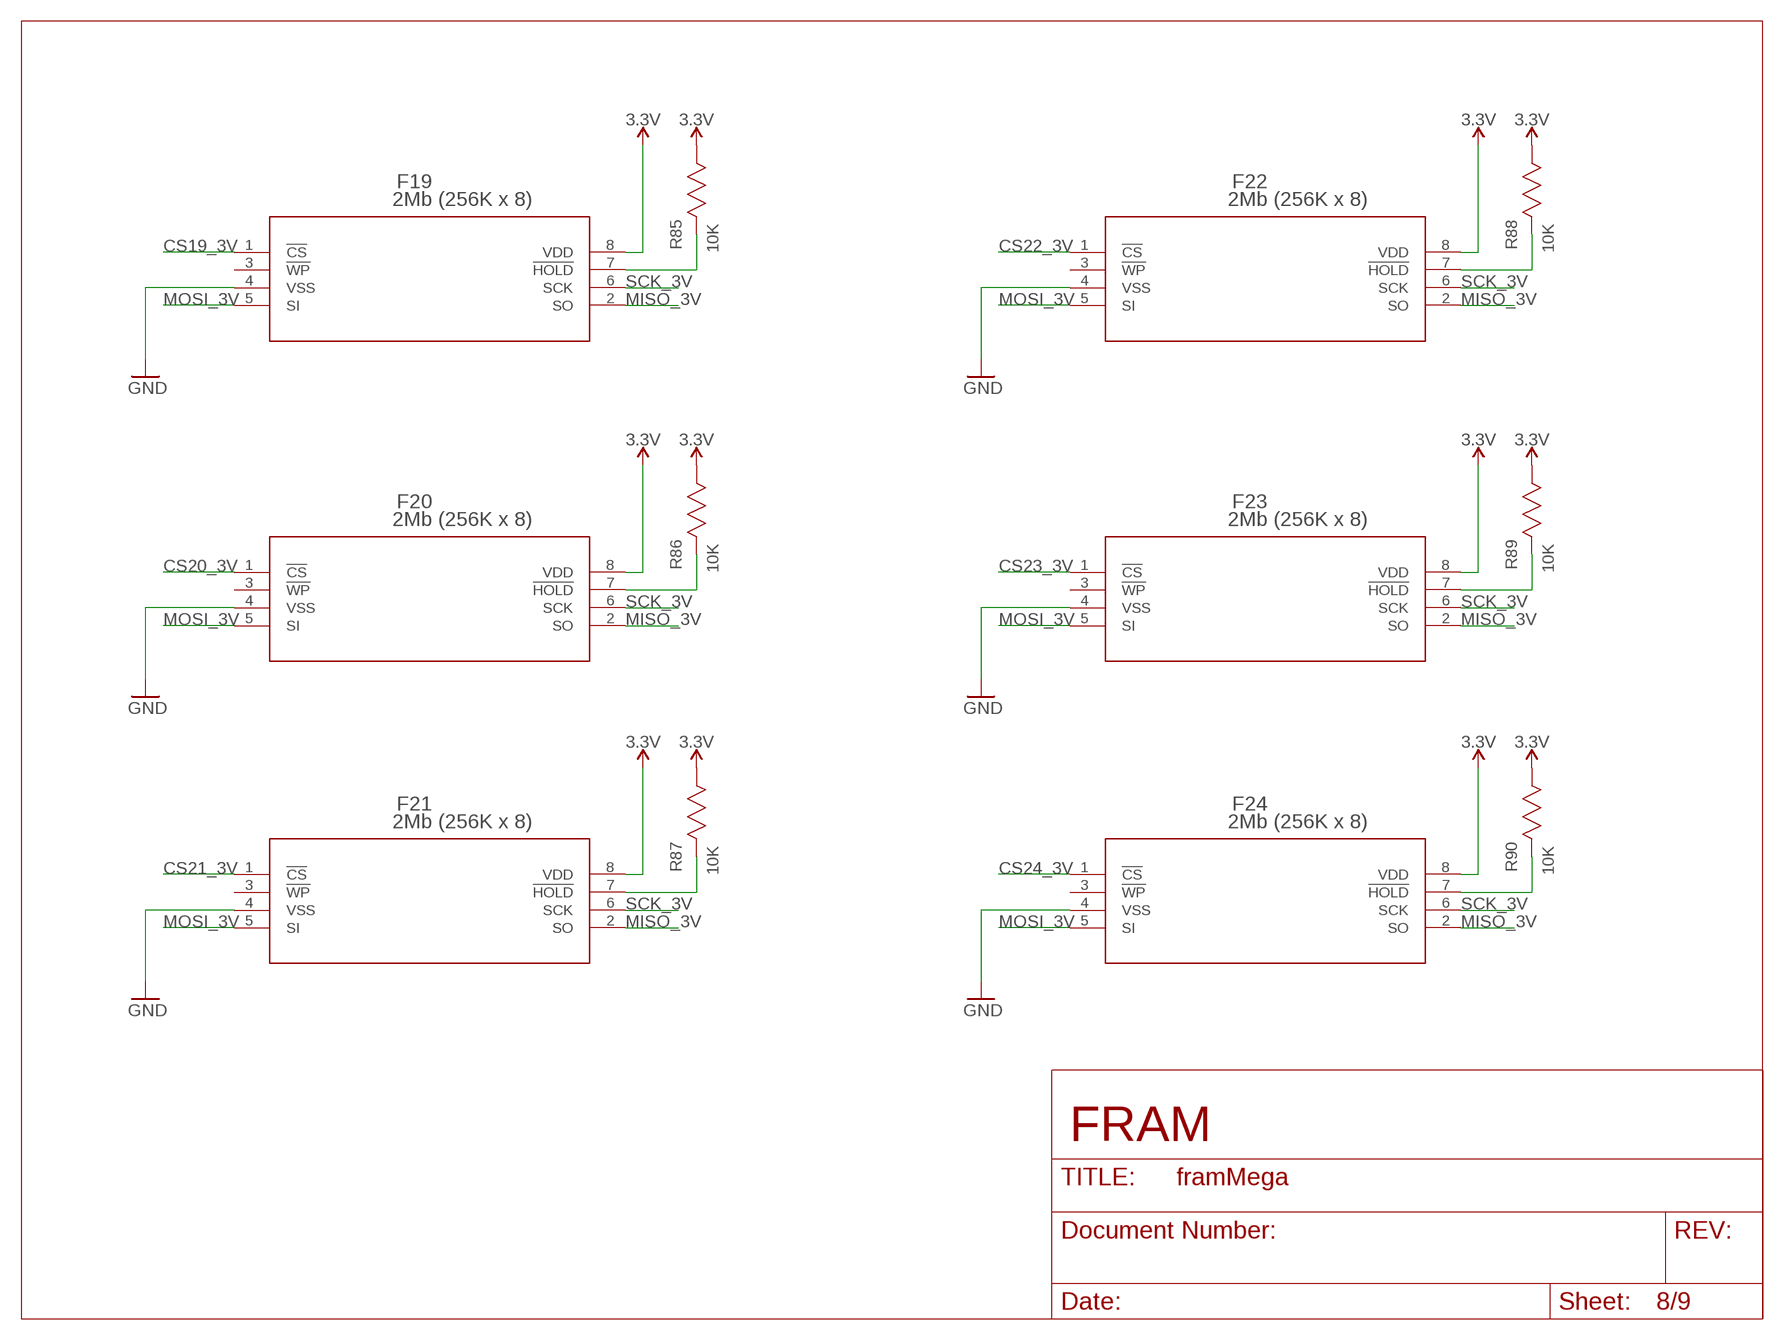
[diagram p7: schematic, sheet 8]

### Parts
F19  2Mb (256K x 8)  FRAM_MB85RS2MTA  [FRAM_MB85RS2MTA_FPT-8P-M09]
F20  2Mb (256K x 8)  FRAM_MB85RS2MTA  [FRAM_MB85RS2MTA_FPT-8P-M09]
F21  2Mb (256K x 8)  FRAM_MB85RS2MTA  [FRAM_MB85RS2MTA_FPT-8P-M09]
F22  2Mb (256K x 8)  FRAM_MB85RS2MTA  [FRAM_MB85RS2MTA_FPT-8P-M09]
F23  2Mb (256K x 8)  FRAM_MB85RS2MTA  [FRAM_MB85RS2MTA_FPT-8P-M09]
F24  2Mb (256K x 8)  FRAM_MB85RS2MTA  [FRAM_MB85RS2MTA_FPT-8P-M09]
R85  10K  RES_10K  [RC0603N]
R86  10K  RES_10K  [RC0603N]
R87  10K  RES_10K  [RC0603N]
R88  10K  RES_10K  [RC0603N]
R89  10K  RES_10K  [RC0603N]
R90  10K  RES_10K  [RC0603N]

### Nets
3.3V: F19.8(VDD) F20.8(VDD) F21.8(VDD) F22.8(VDD) F23.8(VDD) F24.8(VDD) R85.1 R86.1 R87.1 R88.1 R89.1 R90.1 ; also sheet 1,2,3,4,5,6,7,9
CS19_3V: F19.1(!CS) ; also sheet 3
CS20_3V: F20.1(!CS) ; also sheet 3
CS21_3V: F21.1(!CS) ; also sheet 3
CS22_3V: F22.1(!CS) ; also sheet 3
CS23_3V: F23.1(!CS) ; also sheet 3
CS24_3V: F24.1(!CS) ; also sheet 3
GND [gnd]: F19.4(VSS) F20.4(VSS) F21.4(VSS) F22.4(VSS) F23.4(VSS) F24.4(VSS) ; also sheet 1,5,6,7,9
MISO_3V: F19.2(SO) F20.2(SO) F21.2(SO) F22.2(SO) F23.2(SO) F24.2(SO) ; also sheet 2,5,6,7,9
MOSI_3V: F19.5(SI) F20.5(SI) F21.5(SI) F22.5(SI) F23.5(SI) F24.5(SI) ; also sheet 2,5,6,7,9
N$79: F19.7(!HOLD) R85.2
N$81: F22.7(!HOLD) R88.2
N$83: F20.7(!HOLD) R86.2
N$85: F23.7(!HOLD) R89.2
N$87: F21.7(!HOLD) R87.2
N$89: F24.7(!HOLD) R90.2
SCK_3V: F19.6(SCK) F20.6(SCK) F21.6(SCK) F22.6(SCK) F23.6(SCK) F24.6(SCK) ; also sheet 2,5,6,7,9
Unconnected: F19.3(!WP) F20.3(!WP) F21.3(!WP) F22.3(!WP) F23.3(!WP) F24.3(!WP)

### Notes on the sheet
- FRAM

## Sheet 9 of 9
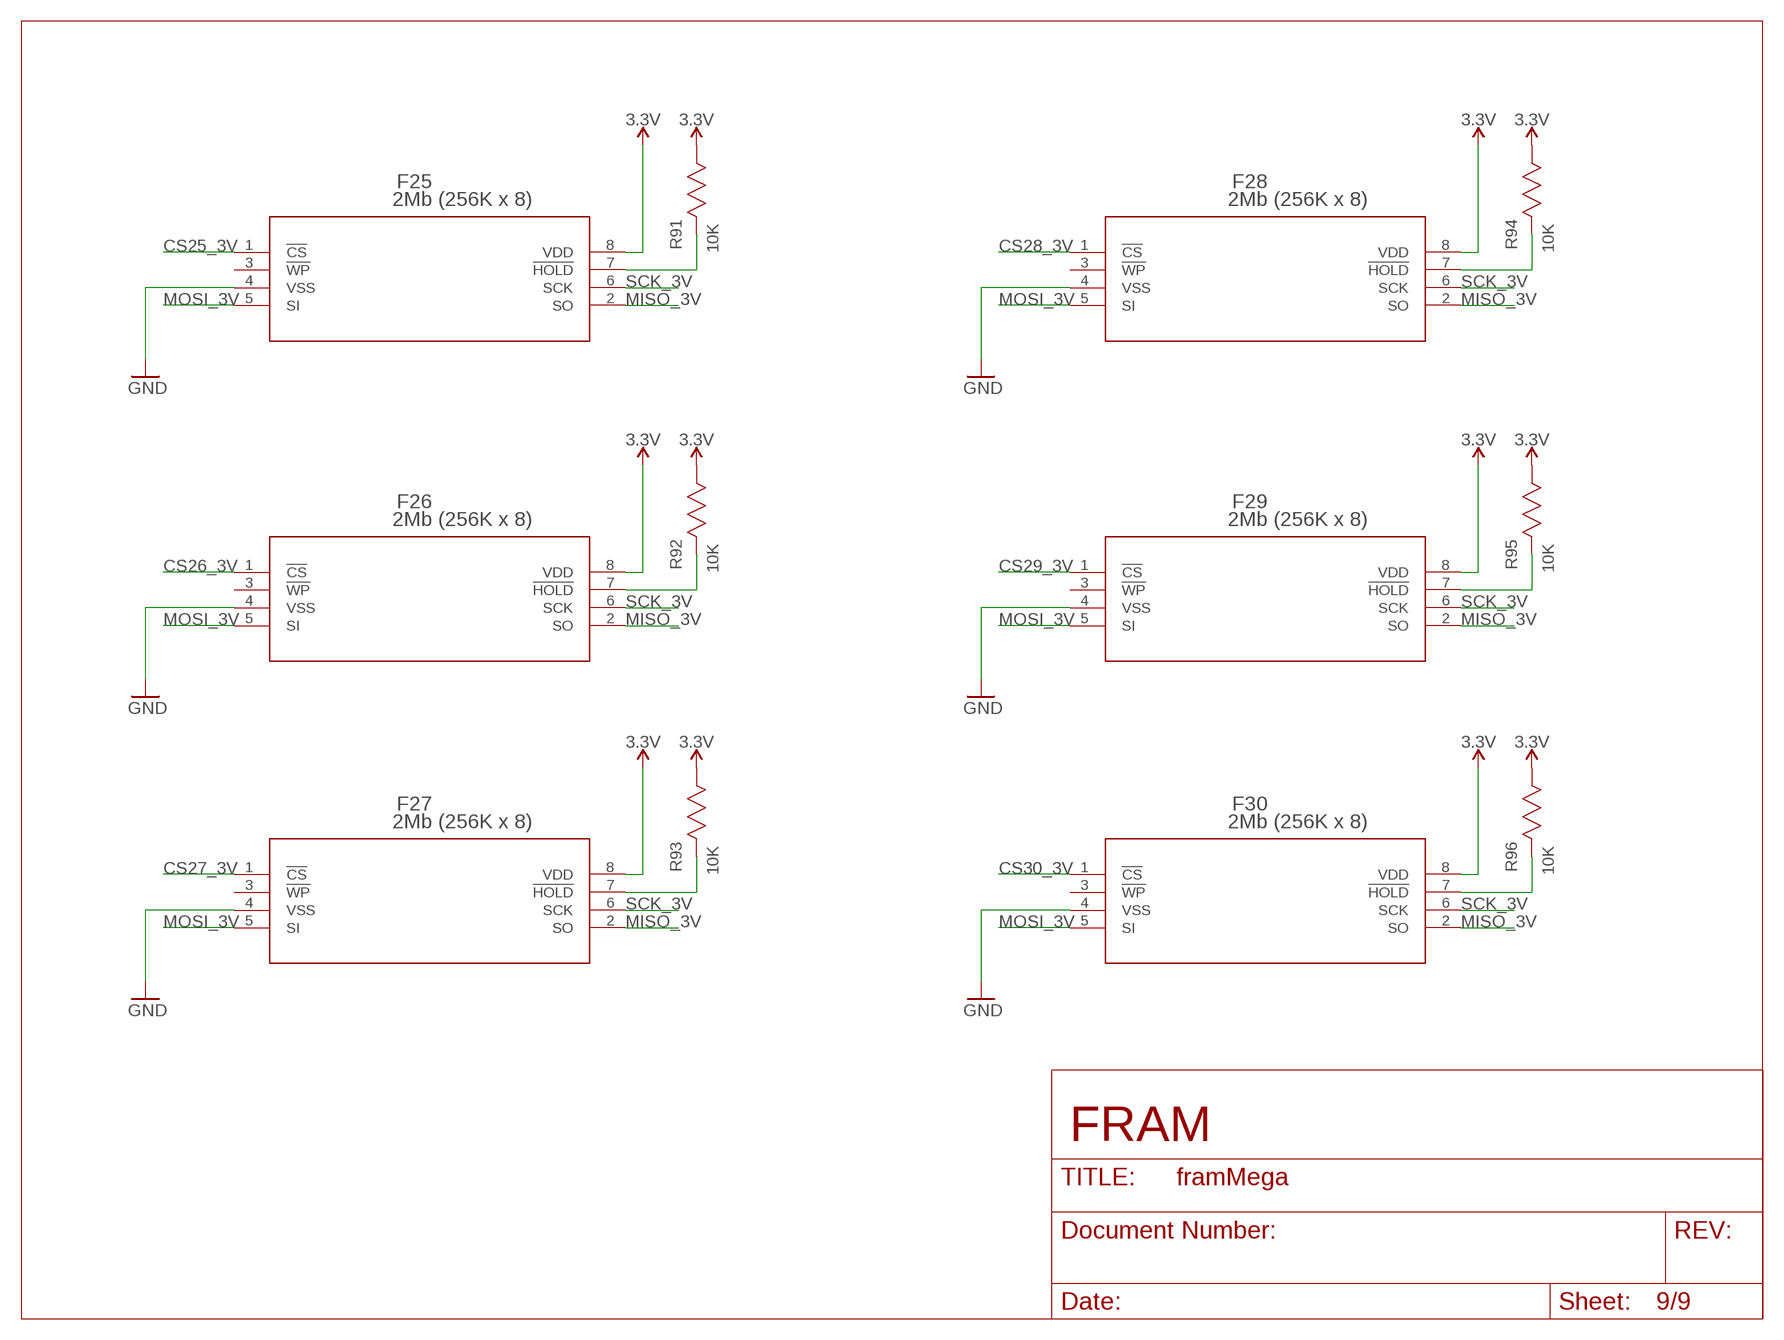
[diagram p8: schematic, sheet 9]

### Parts
F25  2Mb (256K x 8)  FRAM_MB85RS2MTA  [FRAM_MB85RS2MTA_FPT-8P-M09]
F26  2Mb (256K x 8)  FRAM_MB85RS2MTA  [FRAM_MB85RS2MTA_FPT-8P-M09]
F27  2Mb (256K x 8)  FRAM_MB85RS2MTA  [FRAM_MB85RS2MTA_FPT-8P-M09]
F28  2Mb (256K x 8)  FRAM_MB85RS2MTA  [FRAM_MB85RS2MTA_FPT-8P-M09]
F29  2Mb (256K x 8)  FRAM_MB85RS2MTA  [FRAM_MB85RS2MTA_FPT-8P-M09]
F30  2Mb (256K x 8)  FRAM_MB85RS2MTA  [FRAM_MB85RS2MTA_FPT-8P-M09]
R91  10K  RES_10K  [RC0603N]
R92  10K  RES_10K  [RC0603N]
R93  10K  RES_10K  [RC0603N]
R94  10K  RES_10K  [RC0603N]
R95  10K  RES_10K  [RC0603N]
R96  10K  RES_10K  [RC0603N]

### Nets
3.3V: F25.8(VDD) F26.8(VDD) F27.8(VDD) F28.8(VDD) F29.8(VDD) F30.8(VDD) R91.1 R92.1 R93.1 R94.1 R95.1 R96.1 ; also sheet 1,2,3,4,5,6,7,8
CS25_3V: F25.1(!CS) ; also sheet 3
CS26_3V: F26.1(!CS) ; also sheet 3
CS27_3V: F27.1(!CS) ; also sheet 3
CS28_3V: F28.1(!CS) ; also sheet 4
CS29_3V: F29.1(!CS) ; also sheet 4
CS30_3V: F30.1(!CS) ; also sheet 4
GND [gnd]: F25.4(VSS) F26.4(VSS) F27.4(VSS) F28.4(VSS) F29.4(VSS) F30.4(VSS) ; also sheet 1,5,6,7,8
MISO_3V: F25.2(SO) F26.2(SO) F27.2(SO) F28.2(SO) F29.2(SO) F30.2(SO) ; also sheet 2,5,6,7,8
MOSI_3V: F25.5(SI) F26.5(SI) F27.5(SI) F28.5(SI) F29.5(SI) F30.5(SI) ; also sheet 2,5,6,7,8
N$91: F25.7(!HOLD) R91.2
N$93: F28.7(!HOLD) R94.2
N$95: F26.7(!HOLD) R92.2
N$97: F29.7(!HOLD) R95.2
N$99: F27.7(!HOLD) R93.2
N$101: F30.7(!HOLD) R96.2
SCK_3V: F25.6(SCK) F26.6(SCK) F27.6(SCK) F28.6(SCK) F29.6(SCK) F30.6(SCK) ; also sheet 2,5,6,7,8
Unconnected: F25.3(!WP) F26.3(!WP) F27.3(!WP) F28.3(!WP) F29.3(!WP) F30.3(!WP)

### Notes on the sheet
- FRAM

## Library data of the parts
C3 C4 = cubesat_:CAP_10UF: GRM219R61A106KE44D Digikey 490-4735-1-ND
F1-F30 = cubesat_:FRAM_MB85RS2MTA: Digi-Key Part Number 865-1286-6-ND
H1-H4 = holes:MOUNT-PAD-SQUARE: MOUNTING PAD, square
J$1-J$4 = cubesat:WIREPOST
Q1-Q33 = microbuilder:MOSFET-N: N-Channel Mosfet LEGEND VDS: Voltage Drain-Source ID: Drain Current RDS(ON): Drain-Source On-State Resistance VGS(TH): Gate-Source Threshold Voltage CISS: Drain-Source Input Capacitance SOT-23 Name VDS ID RDS(ON) VGS(TH) CISS Order Number 2N7002E 60V 260mA 2.5 Ohm 2.5V @ 250uA 26.7pF @ 25V 2N7002ET1GOSTR-ND BSH103 30V 850mA 400 mOhm 400mV @ 1mA 83pF @ 24V BSH103,235-ND BSS138 60V 320mA 1.6 Ohm 1.5V @ 250uA 50pF @ 10V Mouser: 771-BSS138PW115 DMN2075U-7 20V 4.2A 38 mOhm 1V @ 250 uA 594.3pF @ 10V DMN2075U-7DICT-ND * BSS138 good choice for I2C level-shifting POWERPAK 1212-8 Name VDS ID RDS(ON) VGS(TH) CISS Order Number Si7308DN 60V 6A 58 mOhm 3V @ 250uA 665pF @ 15V SI7308DN-T1-E3CT-ND
R1-R96 = cubesat_:RES_10K
U1 U3 U4 = cubesat_:DS18B20U+T&R: Programmable Resolution 1-Wire Digital Thermometer; AVAILABILITY: Good; DESCRIPTION: Temp Sensor Digital Serial (1-Wire) 8-Pin uMAX T/R; MF: Maxim Integrated; MP: DS18B20U+T&amp;R; PACKAGE: MSOP-8 Maxim Integrated; PRICE: 2.79 USD
U2 = cubesat_:MIC5225: Digikey 576-2980-2-ND

## Net classes
1 power: width 0.61 mm, drill 0.406 mm, clearance 0.205 mm to class 0, clearance 0.205 mm
2 gnd: width 0.305 mm, drill 0.406 mm, clearance 0.205 mm to class 0, clearance 0.205 mm to class 1, clearance 0.205 mm
3 power usb: width 0.508 mm, drill 0.406 mm, clearance 0.205 mm to class 0, clearance 0.205 mm to class 1, clearance 0.205 mm to class 2, clearance 0.205 mm